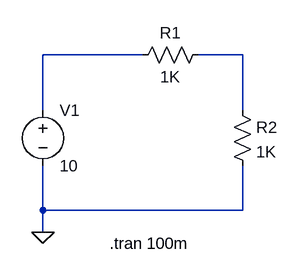
[diagram p0: schematic Voltage-Divider.asc]
Voltage-Divider.asc, the LTspice schematic file:
Version 4.1
SHEET 1 880 680
WIRE 176 48 32 48
WIRE 320 48 256 48
WIRE 32 128 32 48
WIRE 320 128 320 48
WIRE 32 272 32 208
WIRE 320 272 320 208
WIRE 320 272 32 272
WIRE 32 304 32 272
FLAG 32 304 0
SYMBOL voltage 32 112 R0
WINDOW 123 0 0 Left 0
WINDOW 39 0 0 Left 0
SYMATTR InstName V1
SYMATTR Value 10
SYMBOL res 272 32 R90
WINDOW 0 0 56 VBottom 2
WINDOW 3 32 56 VTop 2
SYMATTR InstName R1
SYMATTR Value 1K
SYMBOL res 304 112 R0
SYMATTR InstName R2
SYMATTR Value 1K
TEXT 128 320 Left 2 !.tran 100m

The netlist it stands for:
* Voltage-Divider.asc
V1 N001 0 10
R1 N002 N001 1K
R2 N002 0 1K
.tran 100m
.backanno
.end